# EAGLE schematic EEG_v2_8 (EAGLE 9.5.2)

## Sheet 1 of 2
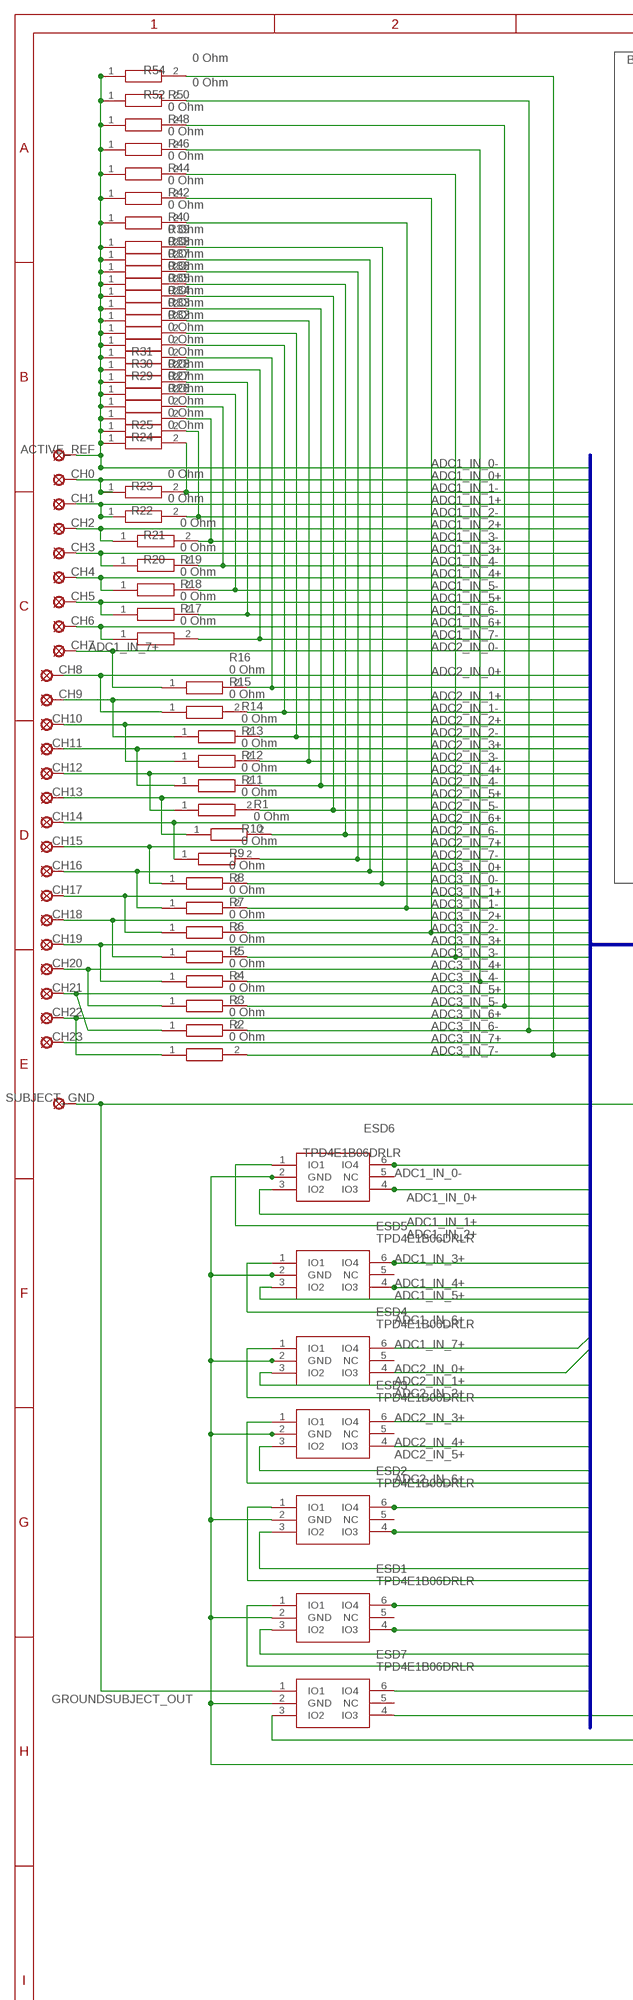
[diagram p0: schematic, sheet 1, part 1 of 2]
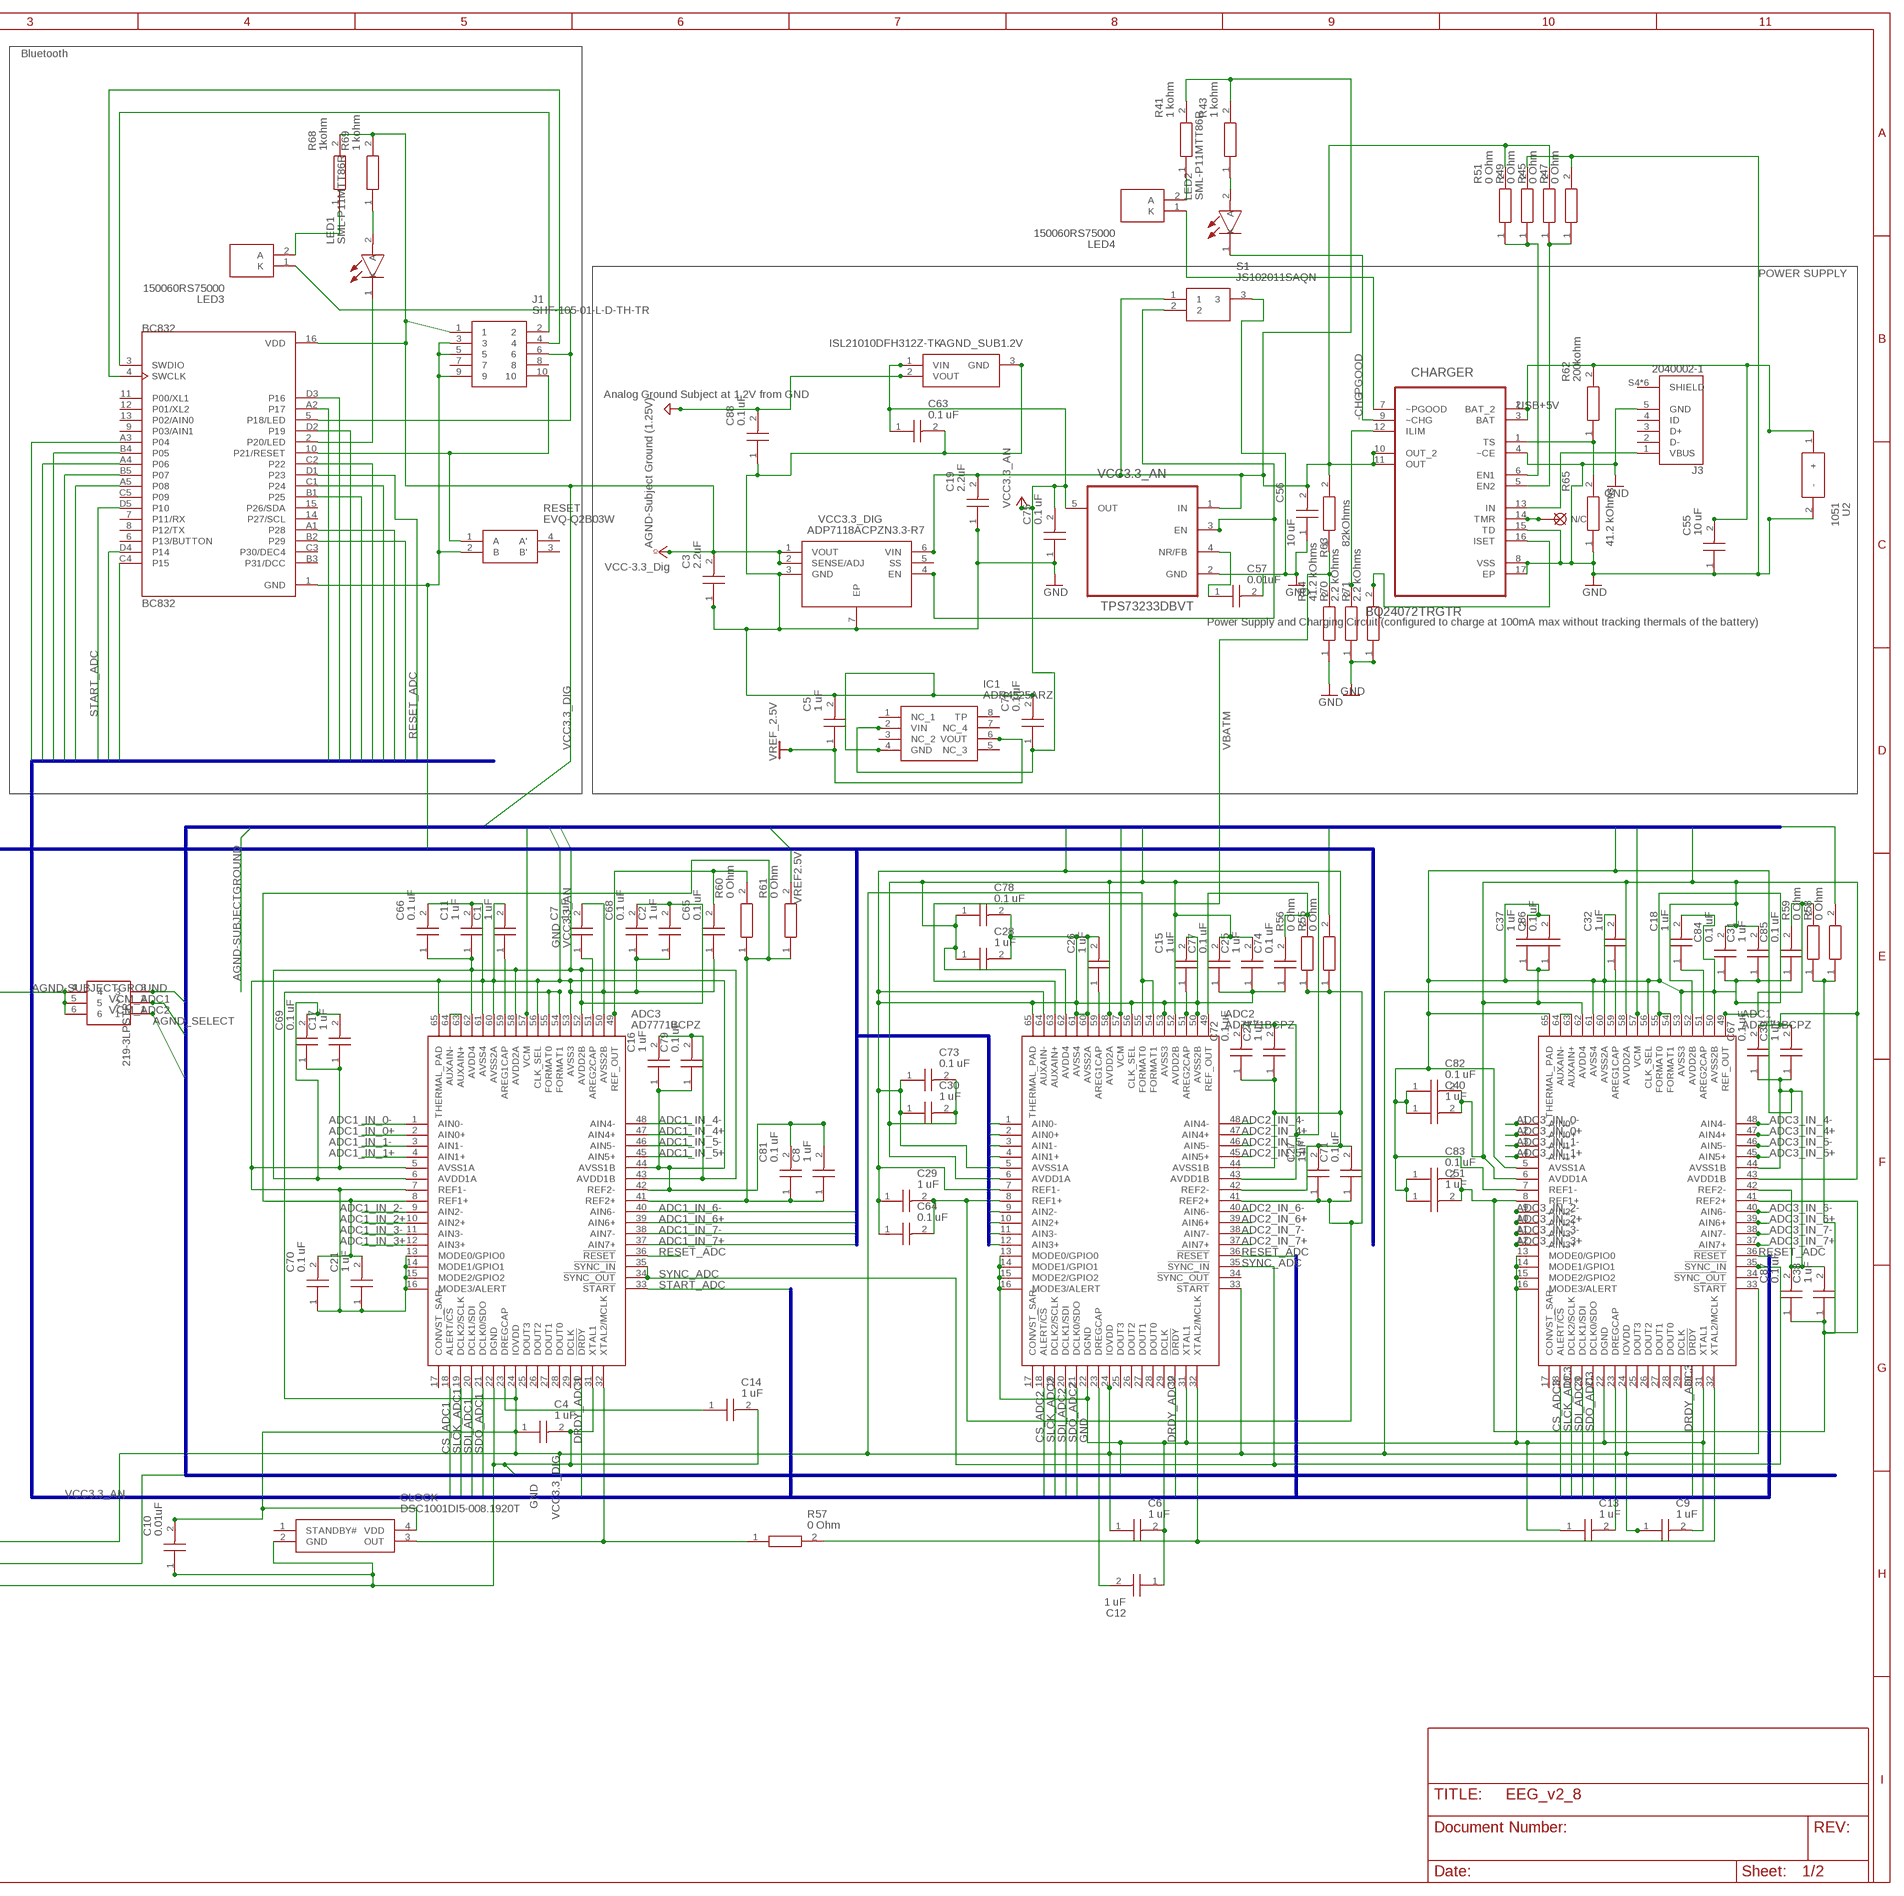
[diagram p1: schematic, sheet 1, part 2 of 2]

### Parts
ACTIVE_REF  SE11  [SE11]
ADC1  AD7771BCPZ  [QFN50P900X900X80-65N]
ADC2  AD7771BCPZ  [QFN50P900X900X80-65N]
ADC3  AD7771BCPZ  [QFN50P900X900X80-65N]
AGND_SELECT  219-3LPSTR  [2193LPSTR]
AGND_SUB1.2V  ISL21010DFH312Z-TK  [SOT95P237X112-3N]
BC832  BC832  [XCVR_BC832]
C1  1 uF  JMK105BJ105MP-F  [CAPC1005X33N]
C2  1 uF  JMK105BJ105MP-F  [CAPC1005X33N]
C3  2.2uF  GRM033R60J225ME47D  [CAPC0603X33N]
C4  1 uF  JMK105BJ105MP-F  [CAPC1005X33N]
C5  1 uF  JMK105BJ105MP-F  [CAPC1005X33N]
C6  1 uF  JMK105BJ105MP-F  [CAPC1005X33N]
C7  1 uF  JMK105BJ105MP-F  [CAPC1005X33N]
C8  1 uF  JMK105BJ105MP-F  [CAPC1005X33N]
C9  1 uF  JMK105BJ105MP-F  [CAPC1005X33N]
C10  0.01uF  GRM033R61E103MA12J  [CAPC0603X33N]
C11  1 uF  JMK105BJ105MP-F  [CAPC1005X33N]
C12  1 uF  JMK105BJ105MP-F  [CAPC1005X33N]
C13  1 uF  JMK105BJ105MP-F  [CAPC1005X33N]
C14  1 uF  JMK105BJ105MP-F  [CAPC1005X33N]
C15  1 uF  JMK105BJ105MP-F  [CAPC1005X33N]
C16  1 uF  JMK105BJ105MP-F  [CAPC1005X33N]
C17  1 uF  JMK105BJ105MP-F  [CAPC1005X33N]
C18  1 uF  JMK105BJ105MP-F  [CAPC1005X33N]
C19  2.2uF  GRM033R60J225ME47D  [CAPC0603X33N]
C21  1 uF  JMK105BJ105MP-F  [CAPC1005X33N]
C24  1 uF  JMK105BJ105MP-F  [CAPC1005X33N]
C25  1 uF  JMK105BJ105MP-F  [CAPC1005X33N]
C26  1 uF  JMK105BJ105MP-F  [CAPC1005X33N]
C27  1 uF  JMK105BJ105MP-F  [CAPC1005X33N]
C28  1 uF  JMK105BJ105MP-F  [CAPC1005X33N]
C29  1 uF  JMK105BJ105MP-F  [CAPC1005X33N]
C30  1 uF  JMK105BJ105MP-F  [CAPC1005X33N]
C31  1 uF  JMK105BJ105MP-F  [CAPC1005X33N]
C32  1 uF  JMK105BJ105MP-F  [CAPC1005X33N]
C37  1 uF  JMK105BJ105MP-F  [CAPC1005X33N]
C38  1 uF  JMK105BJ105MP-F  [CAPC1005X33N]
C39  1 uF  JMK105BJ105MP-F  [CAPC1005X33N]
C40  1 uF  JMK105BJ105MP-F  [CAPC1005X33N]
C51  1 uF  JMK105BJ105MP-F  [CAPC1005X33N]
C55  10 uF  EMK107BBJ106MA-T  [CAPC1608X100N]
C56  10 uF  EMK107BBJ106MA-T  [CAPC1608X100N]
C57  0.01uF  GRM033R61E103MA12J  [CAPC0603X33N]
C63  0.1 uF  LMK063C6104KP-F  [CAPC0603X33N]
C64  0.1 uF  LMK063C6104KP-F  [CAPC0603X33N]
C65  0.1 uF  LMK063C6104KP-F  [CAPC0603X33N]
C66  0.1 uF  LMK063C6104KP-F  [CAPC0603X33N]
C67  0.1 uF  LMK063C6104KP-F  [CAPC0603X33N]
C68  0.1 uF  LMK063C6104KP-F  [CAPC0603X33N]
C69  0.1 uF  LMK063C6104KP-F  [CAPC0603X33N]
C70  0.1 uF  LMK063C6104KP-F  [CAPC0603X33N]
C71  0.1 uF  LMK063C6104KP-F  [CAPC0603X33N]
C72  0.1 uF  LMK063C6104KP-F  [CAPC0603X33N]
C73  0.1 uF  LMK063C6104KP-F  [CAPC0603X33N]
C74  0.1 uF  LMK063C6104KP-F  [CAPC0603X33N]
C75  0.1 uF  LMK063C6104KP-F  [CAPC0603X33N]
C76  0.1 uF  LMK063C6104KP-F  [CAPC0603X33N]
C77  0.1 uF  LMK063C6104KP-F  [CAPC0603X33N]
C78  0.1 uF  LMK063C6104KP-F  [CAPC0603X33N]
C79  0.1 uF  LMK063C6104KP-F  [CAPC0603X33N]
C81  0.1 uF  LMK063C6104KP-F  [CAPC0603X33N]
C82  0.1 uF  LMK063C6104KP-F  [CAPC0603X33N]
C83  0.1 uF  LMK063C6104KP-F  [CAPC0603X33N]
C84  0.1 uF  LMK063C6104KP-F  [CAPC0603X33N]
C85  0.1 uF  LMK063C6104KP-F  [CAPC0603X33N]
C86  0.1 uF  LMK063C6104KP-F  [CAPC0603X33N]
C87  0.1 uF  LMK063C6104KP-F  [CAPC0603X33N]
C88  0.1 uF  LMK063C6104KP-F  [CAPC0603X33N]
CH0  SE11  [SE11]
CH1  SE11  [SE11]
CH2  SE11  [SE11]
CH3  SE11  [SE11]
CH4  SE11  [SE11]
CH5  SE11  [SE11]
CH6  SE11  [SE11]
CH7  SE11  [SE11]
CH8  SE11  [SE11]
CH9  SE11  [SE11]
CH10  SE11  [SE11]
CH11  SE11  [SE11]
CH12  SE11  [SE11]
CH13  SE11  [SE11]
CH14  SE11  [SE11]
CH15  SE11  [SE11]
CH16  SE11  [SE11]
CH17  SE11  [SE11]
CH18  SE11  [SE11]
CH19  SE11  [SE11]
CH20  SE11  [SE11]
CH21  SE11  [SE11]
CH22  SE11  [SE11]
CH23  SE11  [SE11]
CHARGER  BQ24072TRGTR  [QFN50P300X300X100-17N]
CLOCK  DSC1001DI5-008.1920T  [DSC1001DI50081920T]
ESD1  TPD4E1B06DRLR  [SOP50P160X60-6N]
ESD2  TPD4E1B06DRLR  [SOP50P160X60-6N]
ESD3  TPD4E1B06DRLR  [SOP50P160X60-6N]
ESD4  TPD4E1B06DRLR  [SOP50P160X60-6N]
ESD5  TPD4E1B06DRLR  [SOP50P160X60-6N]
ESD6  TPD4E1B06DRLR  [SOP50P160X60-6N]
ESD7  TPD4E1B06DRLR  [SOP50P160X60-6N]
IC1  ADR4525ARZ  [SOIC127P600X175-8N]
J1  SHF-105-01-L-D-TH-TR  [SHF10501LDTHTR]
J3  2040002-1  [TE_2040002-1]
LED1  SML-P11MTT86R  [LEDC1006X25N]
LED2  SML-P11MTT86R  [LEDC1006X25N]
LED3  150060RS75000  [LEDC1608X80N]
LED4  150060RS75000  [LEDC1608X80N]
R1  0 Ohm  CRCW06030000Z0EAC  [RESC1608X55N]
R2  0 Ohm  CRCW06030000Z0EAC  [RESC1608X55N]
R3  0 Ohm  CRCW06030000Z0EAC  [RESC1608X55N]
R4  0 Ohm  CRCW06030000Z0EAC  [RESC1608X55N]
R5  0 Ohm  CRCW06030000Z0EAC  [RESC1608X55N]
R6  0 Ohm  CRCW06030000Z0EAC  [RESC1608X55N]
R7  0 Ohm  CRCW06030000Z0EAC  [RESC1608X55N]
R8  0 Ohm  CRCW06030000Z0EAC  [RESC1608X55N]
R9  0 Ohm  CRCW06030000Z0EAC  [RESC1608X55N]
R10  0 Ohm  CRCW06030000Z0EAC  [RESC1608X55N]
R11  0 Ohm  CRCW06030000Z0EAC  [RESC1608X55N]
R12  0 Ohm  CRCW06030000Z0EAC  [RESC1608X55N]
R13  0 Ohm  CRCW06030000Z0EAC  [RESC1608X55N]
R14  0 Ohm  CRCW06030000Z0EAC  [RESC1608X55N]
R15  0 Ohm  CRCW06030000Z0EAC  [RESC1608X55N]
R16  0 Ohm  CRCW06030000Z0EAC  [RESC1608X55N]
R17  0 Ohm  CRCW06030000Z0EAC  [RESC1608X55N]
R18  0 Ohm  CRCW06030000Z0EAC  [RESC1608X55N]
R19  0 Ohm  CRCW06030000Z0EAC  [RESC1608X55N]
R20  0 Ohm  CRCW06030000Z0EAC  [RESC1608X55N]
R21  0 Ohm  CRCW06030000Z0EAC  [RESC1608X55N]
R22  0 Ohm  CRCW06030000Z0EAC  [RESC1608X55N]
R23  0 Ohm  CRCW06030000Z0EAC  [RESC1608X55N]
R24  0 Ohm  CRCW06030000Z0EAC  [RESC1608X55N]
R25  0 Ohm  CRCW06030000Z0EAC  [RESC1608X55N]
R26  0 Ohm  CRCW06030000Z0EAC  [RESC1608X55N]
R27  0 Ohm  CRCW06030000Z0EAC  [RESC1608X55N]
R28  0 Ohm  CRCW06030000Z0EAC  [RESC1608X55N]
R29  0 Ohm  CRCW06030000Z0EAC  [RESC1608X55N]
R30  0 Ohm  CRCW06030000Z0EAC  [RESC1608X55N]
R31  0 Ohm  CRCW06030000Z0EAC  [RESC1608X55N]
R32  0 Ohm  CRCW06030000Z0EAC  [RESC1608X55N]
R33  0 Ohm  CRCW06030000Z0EAC  [RESC1608X55N]
R34  0 Ohm  CRCW06030000Z0EAC  [RESC1608X55N]
R35  0 Ohm  CRCW06030000Z0EAC  [RESC1608X55N]
R36  0 Ohm  CRCW06030000Z0EAC  [RESC1608X55N]
R37  0 Ohm  CRCW06030000Z0EAC  [RESC1608X55N]
R38  0 Ohm  CRCW06030000Z0EAC  [RESC1608X55N]
R39  0 Ohm  CRCW06030000Z0EAC  [RESC1608X55N]
R40  0 Ohm  CRCW06030000Z0EAC  [RESC1608X55N]
R41  1 kohm  RC0201JR-071KL  [RESC0603X26N]
R42  0 Ohm  CRCW06030000Z0EAC  [RESC1608X55N]
R43  1 kohm  RC0201JR-071KL  [RESC0603X26N]
R44  0 Ohm  CRCW06030000Z0EAC  [RESC1608X55N]
R45  0 Ohm  CRCW06030000Z0EAC  [RESC1608X55N]
R46  0 Ohm  CRCW06030000Z0EAC  [RESC1608X55N]
R47  0 Ohm  CRCW06030000Z0EAC  [RESC1608X55N]
R48  0 Ohm  CRCW06030000Z0EAC  [RESC1608X55N]
R49  0 Ohm  CRCW06030000Z0EAC  [RESC1608X55N]
R50  0 Ohm  CRCW06030000Z0EAC  [RESC1608X55N]
R51  0 Ohm  CRCW06030000Z0EAC  [RESC1608X55N]
R52  0 Ohm  CRCW06030000Z0EAC  [RESC1608X55N]
R54  0 Ohm  CRCW06030000Z0EAC  [RESC1608X55N]
R55  0 Ohm  CRCW06030000Z0EAC  [RESC1608X55N]
R56  0 Ohm  CRCW06030000Z0EAC  [RESC1608X55N]
R57  0 Ohm  CRCW06030000Z0EAC  [RESC1608X55N]
R58  0 Ohm  CRCW06030000Z0EAC  [RESC1608X55N]
R59  0 Ohm  CRCW06030000Z0EAC  [RESC1608X55N]
R60  0 Ohm  CRCW06030000Z0EAC  [RESC1608X55N]
R61  0 Ohm  CRCW06030000Z0EAC  [RESC1608X55N]
R62  200kohm  CRCW0201200KFNED  [RESC0603X28N]
R63  82kOhms  ERA-3AEB823V  [RESC1608X55N]
R64  41.2 kOhms  CRCW020141K2FNED  [RESC0603X28N]
R65  41.2 kOhms  CRCW020141K2FNED  [RESC0603X28N]
R68  1kohm  RC0201JR-071KL  [RESC0603X26N]
R69  1 kohm  RC0201JR-071KL  [RESC0603X26N]
R70  2.2 kOhms  RC0603JR-072K2L  [RESC1608X55N]
R71  2.2 kOhms  RC0603JR-072K2L  [RESC1608X55N]
RESET  EVQ-Q2B03W  [EVQQ2]
S1  JS102011SAQN  [JS102011SAQN]
SUBJECT_GND  SE11  [SE11]
U2  1051  [1051]
U$13  N/C  (no package)
VCC3.3_AN  TPS73233DBVT  [SOT95P280X145-5N]
VCC3.3_DIG  ADP7118ACPZN3.3-R7  [SON65P200X200X65-7N]

### Nets
-CHG: CHARGER.9(~CHG) LED2.1(K)
-PGOOD: CHARGER.7(~PGOOD) LED4.1(K)
ADC1_IN_0+: ADC3.2(AIN0+) CH0.MP ESD6.4(IO3) R23.1
ADC1_IN_0-: ACTIVE_REF.MP ADC3.1(AIN0-) ESD6.6(IO4) R24.1 R25.1 R26.1 R27.1 R28.1 R29.1 R30.1 R31.1 R32.1 R33.1 R34.1 R35.1 R36.1 R37.1 R38.1 R39.1 R40.1 R42.1 R44.1 R46.1 R48.1 R50.1 R52.1 R54.1
ADC1_IN_1+: ADC3.4(AIN1+) CH1.MP ESD6.3(IO2) R22.1
ADC1_IN_1-: ADC3.3(AIN1-) R23.2 R24.2
ADC1_IN_2+: ADC3.10(AIN2+) CH2.MP ESD6.1(IO1) R21.1
ADC1_IN_2-: ADC3.9(AIN2-) R22.2 R25.2
ADC1_IN_3+: ADC3.12(AIN3+) CH3.MP ESD5.6(IO4) R20.1
ADC1_IN_3-: ADC3.11(AIN3-) R21.2 R26.2
ADC1_IN_4+: ADC3.47(AIN4+) CH4.MP ESD5.4(IO3) R19.1
ADC1_IN_4-: ADC3.48(AIN4-) R20.2 R27.2
ADC1_IN_5+: ADC3.45(AIN5+) CH5.MP ESD5.3(IO2) R18.1
ADC1_IN_5-: ADC3.46(AIN5-) R19.2 R28.2
ADC1_IN_6+: ADC3.39(AIN6+) CH6.MP ESD5.1(IO1) R17.1
ADC1_IN_6-: ADC3.40(AIN6-) R18.2 R29.2
ADC1_IN_7+: ADC3.37(AIN7+) CH7.MP ESD4.4(IO3) R16.1
ADC1_IN_7-: ADC3.38(AIN7-) R17.2 R30.2
ADC2_IN_0+: ADC2.2(AIN0+) CH8.MP ESD4.6(IO4) R15.1
ADC2_IN_0-: ADC2.1(AIN0-) R16.2 R31.2
ADC2_IN_1+: ADC2.4(AIN1+) CH9.MP ESD4.3(IO2) R14.1
ADC2_IN_1-: ADC2.3(AIN1-) R15.2 R32.2
ADC2_IN_2+: ADC2.10(AIN2+) CH10.MP ESD4.1(IO1) R13.1
ADC2_IN_2-: ADC2.9(AIN2-) R14.2 R33.2
ADC2_IN_3+: ADC2.12(AIN3+) CH11.MP ESD3.4(IO3) R12.1
ADC2_IN_3-: ADC2.11(AIN3-) R13.2 R34.2
ADC2_IN_4+: ADC2.47(AIN4+) CH12.MP ESD3.6(IO4) R11.1
ADC2_IN_4-: ADC2.48(AIN4-) R12.2 R35.2
ADC2_IN_5+: ADC2.45(AIN5+) CH13.MP ESD3.3(IO2) R1.1
ADC2_IN_5-: ADC2.46(AIN5-) R11.2 R36.2
ADC2_IN_6+: ADC2.39(AIN6+) CH14.MP ESD3.1(IO1) R10.1
ADC2_IN_6-: ADC2.40(AIN6-) R1.2 R37.2
ADC2_IN_7+: ADC2.37(AIN7+) CH15.MP ESD2.6(IO4) R9.1
ADC2_IN_7-: ADC2.38(AIN7-) R10.2 R38.2
ADC3_IN_0+: ADC1.2(AIN0+) CH16.MP ESD2.4(IO3) R8.1 R39.2
ADC3_IN_0-: ADC1.1(AIN0-) R9.2 R40.2
ADC3_IN_1+: ADC1.4(AIN1+) CH17.MP ESD2.3(IO2) R7.1
ADC3_IN_1-: ADC1.3(AIN1-) R8.2 R42.2
ADC3_IN_2+: ADC1.10(AIN2+) CH18.MP ESD2.1(IO1) R6.1
ADC3_IN_2-: ADC1.9(AIN2-) R7.2 R44.2
ADC3_IN_3+: ADC1.12(AIN3+) CH19.MP ESD1.6(IO4) R5.1
ADC3_IN_3-: ADC1.11(AIN3-) R6.2 R46.2
ADC3_IN_4+: ADC1.47(AIN4+) CH20.MP ESD1.4(IO3) R4.1
ADC3_IN_4-: ADC1.48(AIN4-) R5.2 R48.2
ADC3_IN_5+: ADC1.45(AIN5+) CH21.MP ESD1.3(IO2) R3.1
ADC3_IN_5-: ADC1.46(AIN5-) R4.2 R50.2
ADC3_IN_6+: ADC1.39(AIN6+) CH22.MP ESD1.1(IO1) R2.1
ADC3_IN_6-: ADC1.40(AIN6-) R3.2 R52.2
ADC3_IN_7+: ADC1.37(AIN7+) CH23.MP ESD7.6(IO4)
ADC3_IN_7-: ADC1.38(AIN7-) R2.2 R54.2
AGND-SUBJECTGROUND [power]: AGND_SELECT.3 AGND_SUB1.2V.2(VOUT) C88.2 ; supply symbol labelled AGND-Subject Ground (1.25V)
CS_ADC1: ADC3.18(ALERT/!CS) BC832.A4(P06)
CS_ADC2: ADC2.18(ALERT/!CS) BC832.A5(P08)
CS_ADC3: ADC1.18(ALERT/!CS) BC832.C1(P24)
DRDY_ADC1: ADC3.30(!DRDY) BC832.A2(P17)
DRDY_ADC2: ADC2.30(!DRDY) BC832.D4(P14)
DRDY_ADC3: ADC1.30(!DRDY) BC832.B1(P25)
GND [power]: ADC1.5(AVSS1A) ADC1.7(REF1-) ADC1.13(MODE0/GPIO0) ADC1.14(MODE1/GPIO1) ADC1.15(MODE2/GPIO2) ADC1.16(MODE3/ALERT) ADC1.22(DGND) ADC1.31(XTAL1) ADC1.42(REF2-) ADC1.44(AVSS1B) ADC1.50(AVSS2B) ADC1.53(AVSS3) ADC1.56(CLK_SEL) ADC1.60(AVSS2A) ADC1.61(AVSS4) ADC1.65(THERMAL_PAD) ADC2.5(AVSS1A) ADC2.7(REF1-) ADC2.13(MODE0/GPIO0) ADC2.14(MODE1/GPIO1) ADC2.15(MODE2/GPIO2) ADC2.16(MODE3/ALERT) ADC2.22(DGND) ADC2.31(XTAL1) ADC2.42(REF2-) ADC2.44(AVSS1B) ADC2.50(AVSS2B) ADC2.53(AVSS3) ADC2.56(CLK_SEL) ADC2.60(AVSS2A) ADC2.61(AVSS4) ADC2.64(AUXAIN-) ADC2.65(THERMAL_PAD) ADC3.5(AVSS1A) ADC3.7(REF1-) ADC3.13(MODE0/GPIO0) ADC3.14(MODE1/GPIO1) ADC3.15(MODE2/GPIO2) ADC3.16(MODE3/ALERT) ADC3.22(DGND) ADC3.31(XTAL1) ADC3.42(REF2-) ADC3.44(AVSS1B) ADC3.50(AVSS2B) ADC3.53(AVSS3) ADC3.56(CLK_SEL) ADC3.60(AVSS2A) ADC3.61(AVSS4) ADC3.65(THERMAL_PAD) AGND_SUB1.2V.3(GND) BC832.1(GND) C1.2 C2.1 C3.1 C4.2 C5.2 C6.2 C7.2 C8.2 C9.2 C10.1 C11.2 C12.1 C13.1 C14.2 C15.2 C16.1 C17.1 C18.2 C19.1 C21.1 C24.1 C25.1 C26.2 C27.2 C28.2 C29.1 C30.1 C31.1 C32.2 C37.2 C38.2 C39.1 C40.1 C51.1 C55.1 C56.1 C57.2 C63.2 C64.1 C65.1 C66.2 C67.1 C68.1 C69.1 C70.1 C71.2 C72.1 C73.1 C74.1 C75.1 C76.2 C77.1 C78.2 C79.1 C81.2 C82.1 C83.1 C84.1 C85.1 C86.2 C87.2 C88.1 CHARGER.4(~CE) CHARGER.8(VSS) CHARGER.15(TD) CHARGER.17(EP) CLOCK.2(GND) ESD1.2(GND) ESD2.2(GND) ESD3.2(GND) ESD4.2(GND) ESD5.2(GND) ESD6.2(GND) ESD7.2(GND) IC1.4(GND) J1.3 J1.5 J1.9 J3.5(GND) R47.2 R49.2 R64.1 R65.1 R70.1 R71.1 RESET.2(B) S1.3 U2.2(-) VCC3.3_AN.2(GND) VCC3.3_DIG.3(GND) VCC3.3_DIG.7(EP)
GROUNDSUBJECT_OUT [power]: AGND_SELECT.4 AGND_SELECT.5 AGND_SELECT.6 ESD7.1(IO1) SUBJECT_GND.MP
N$1: ADC3.59(AREG1CAP) C1.1
N$2: ADC2.23(DREGCAP) C12.2
N$3: ADC2.49(REF_OUT) C74.2 R56.2
N$4: ADC1.49(REF_OUT) C85.2 R59.2
N$5: CHARGER.6(EN1) R49.1 R51.1
N$6: BC832.2(P20/LED) LED1.1(K)
N$7: ADC3.63(AUXAIN+) ADC3.64(AUXAIN-)
N$8: ADC3.51(AREG2CAP) C7.1
N$9: S1.2 VCC3.3_AN.3(EN) VCC3.3_DIG.4(EN)
N$10: LED3.2(A) R68.1
N$11: LED1.2(A) R69.1
N$12: LED4.2(A) R41.1
N$13: ADC2.51(AREG2CAP) C15.1
N$14: ADC3.23(DREGCAP) C14.1
N$15: CHARGER.5(EN2) R45.1 R47.1
N$16: ADC1.23(DREGCAP) C13.2
N$17: LED2.2(A) R43.1
N$19: C57.1 VCC3.3_AN.4(NR/FB)
N$20: ADC1.63(AUXAIN+) ADC1.64(AUXAIN-)
N$21: ADC1.59(AREG1CAP) C32.1
N$22: ADC2.59(AREG1CAP) C26.1
N$26: ADC1.51(AREG2CAP) C18.1
N$31: ADC2.8(REF1+) ADC2.41(REF2+) C27.1 C29.2 C64.2 C71.1 R55.1 R56.1
N$38: ADC1.8(REF1+) ADC1.41(REF2+) C38.1 C51.2 C83.2 C87.1 R58.1 R59.1
N$39: CHARGER.1(TS) R62.1 R65.2
N$53: CHARGER.14(TMR) U$13.N/C
N$58: CHARGER.16(ISET) R71.2
N$60: CHARGER.12(ILIM) R70.2
P18/LED: BC832.5(P18/LED) J1.6 LED3.1(K)
REF_ADC1_IN: ADC3.8(REF1+) ADC3.41(REF2+) C8.1 C21.2 C70.2 C81.1 R60.1 R61.1
REF_ADC1_OUT: ADC3.49(REF_OUT) C65.2 R60.2
RESET: BC832.10(P21/RESET) J1.10 RESET.1(A)
RESET_ADC: ADC1.36(!RESET) ADC2.36(!RESET) ADC3.36(!RESET) BC832.D1(P23)
SDCLK: BC832.4(SWCLK) J1.4
SDI_ADC1: ADC3.20(DCLK1/SDI) BC832.C4(P15)
SDI_ADC2: ADC2.20(DCLK1/SDI) BC832.B5(P07)
SDI_ADC3: ADC1.20(DCLK1/SDI) BC832.A1(P28)
SDIO: BC832.3(SWDIO) J1.2
SDO_ADC1: ADC3.21(DCLK0/SDO) BC832.D3(P16)
SDO_ADC2: ADC2.21(DCLK0/SDO) BC832.B4(P05)
SDO_ADC3: ADC1.21(DCLK0/SDO) BC832.B2(P29)
SLCK_ADC1: ADC3.19(DCLK2/SCLK) BC832.A3(P04)
SLCK_ADC2: ADC2.19(DCLK2/SCLK) BC832.D2(P19)
SLCK_ADC3: ADC1.19(DCLK2/SCLK) BC832.C2(P22)
START_ADC: ADC3.33(!START) BC832.D5(P10)
SYNC_ADC: ADC1.35(!SYNC_IN) ADC2.35(!SYNC_IN) ADC3.34(!SYNC_OUT) ADC3.35(!SYNC_IN)
USB+5V [power]: CHARGER.13(IN) J3.1(VBUS)
V_OUT: C19.2 C56.2 CHARGER.10(OUT_2) CHARGER.11(OUT) R41.2 R43.2 R45.2 R51.2 R63.2 S1.1 VCC3.3_AN.1(IN) VCC3.3_DIG.6(VIN)
VBATM [power]: ADC2.63(AUXAIN+) R63.1 R64.2
VCC3.3_AN [power2]: ADC1.6(AVDD1A) ADC1.43(AVDD1B) ADC1.52(AVDD2B) ADC1.58(AVDD2A) ADC1.62(AVDD4) ADC2.6(AVDD1A) ADC2.43(AVDD1B) ADC2.52(AVDD2B) ADC2.58(AVDD2A) ADC2.62(AVDD4) ADC3.6(AVDD1A) ADC3.43(AVDD1B) ADC3.52(AVDD2B) ADC3.58(AVDD2A) ADC3.62(AVDD4) AGND_SUB1.2V.1(VIN) C2.2 C11.1 C16.2 C17.2 C24.2 C25.2 C28.1 C30.2 C31.2 C37.1 C39.2 C40.2 C63.1 C66.1 C67.2 C68.2 C69.2 C72.2 C73.2 C75.2 C76.1 C77.2 C78.1 C79.2 C82.2 C84.2 C86.1 ESD7.3(IO2) IC1.2(VIN) VCC3.3_AN.5(OUT)
VCC3.3_DIG [power2]: ADC1.24(IOVDD) ADC1.33(!START) ADC1.54(FORMAT1) ADC1.55(FORMAT0) ADC2.24(IOVDD) ADC2.33(!START) ADC2.54(FORMAT1) ADC2.55(FORMAT0) ADC3.24(IOVDD) ADC3.54(FORMAT1) ADC3.55(FORMAT0) BC832.16(VDD) C3.2 C4.1 C6.1 C9.1 C10.2 CLOCK.4(VDD) ESD7.4(IO3) J1.1 R68.2 R69.2 VCC3.3_DIG.1(VOUT) VCC3.3_DIG.2(SENSE/ADJ) ; supply symbol labelled VCC-3.3_Dig
VCC_BATTERY [power2]: C55.2 CHARGER.2(BAT_2) CHARGER.3(BAT) R62.2 U2.1(+)
VCM_ADC1: ADC3.57(VCM) AGND_SELECT.2
VCM_ADC2: ADC2.57(VCM) AGND_SELECT.1
VCM_ADC3: ADC1.57(VCM)
VREF2.5V: C5.1 IC1.6(VOUT) R55.2 R58.2 R61.2 ; supply symbol labelled VREF_2.5V
XTAL_OUT: ADC3.32(XTAL2/MCLK) CLOCK.3(OUT) R57.1
XTAL_OUT_SWITCHED: ADC1.32(XTAL2/MCLK) ADC2.32(XTAL2/MCLK) R57.2
Unconnected: ADC1.17(CONVST_SAR) ADC1.25(DOUT3) ADC1.26(DOUT2) ADC1.27(DOUT1) ADC1.28(DOUT0) ADC1.29(DCLK) ADC1.34(!SYNC_OUT) ADC2.17(CONVST_SAR) ADC2.25(DOUT3) ADC2.26(DOUT2) ADC2.27(DOUT1) ADC2.28(DOUT0) ADC2.29(DCLK) ADC2.34(!SYNC_OUT) ADC3.17(CONVST_SAR) ADC3.25(DOUT3) ADC3.26(DOUT2) ADC3.27(DOUT1) ADC3.28(DOUT0) ADC3.29(DCLK) BC832.6(P13/BUTTON) BC832.7(P11/RX) BC832.8(P12/TX) BC832.9(P03/AIN1) BC832.11(P00/XL1) BC832.12(P01/XL2) BC832.13(P02/AIN0) BC832.14(P27/SCL) BC832.15(P26/SDA) BC832.B3(P31/DCC) BC832.C3(P30/DEC4) BC832.C5(P09) CLOCK.1(STANDBY#) ESD1.5(NC) ESD2.5(NC) ESD3.5(NC) ESD4.5(NC) ESD5.5(NC) ESD6.5(NC) ESD7.5(NC) IC1.1(NC_1) IC1.3(NC_2) IC1.5(NC_3) IC1.7(NC_4) IC1.8(TP) J1.7 J1.8 J3.2(D-) J3.3(D+) J3.4(ID) RESET.3(B') RESET.4(A') VCC3.3_DIG.5(SS)

### Buses
ADC1_IN_0-,ADC1_IN_0+,ADC1_IN_1-,ADC1_IN_1+,ADC1_IN_2-,ADC1_IN_2+,ADC1_IN_3-,ADC1_IN_3+,ADC1_IN_4-,ADC1_IN_4+,ADC1_IN_5-,ADC1_IN_5+,ADC1_IN_6-,ADC1_IN_6+,ADC1_IN_7-,ADC1_IN_7+,ADC2_IN_0+,ADC2_IN_0-,ADC2_IN_1+,ADC2_IN_1-,ADC2_IN_2+,ADC2_IN_2-,ADC2_IN_3+,ADC2_IN_3-,ADC2_IN_4+,ADC2_IN_4-,ADC2_IN_5+,ADC2_IN_5-,ADC2_IN_6+,ADC2_IN_6-,ADC2_IN_7+,ADC2_IN_7-,ADC3_IN_0-,ADC3_IN_0+,ADC3_IN_1-,ADC3_IN_1+,ADC3_IN_2-,ADC3_IN_2+,ADC3_IN_3+,ADC3_IN_3-,ADC3_IN_4-,ADC3_IN_4+,ADC3_IN_5-,ADC3_IN_5+,ADC3_IN_6-,ADC3_IN_6+,ADC3_IN_7-,ADC3_IN_7+,GND,N$52,VCC3.3_AN,VREF2.5V
POWER:AGND-SUBJECTGROUND,GND,VCC3.3_AN,VCC3.3_DIG,VCM_ADC1,VCM_ADC2,VCM_ADC3,VREF2.5V
CS_ADC1,CS_ADC2,CS_ADC3,DRDY_ADC1,DRDY_ADC2,DRDY_ADC3,RESET_ADC,SDI_ADC1,SDI_ADC2,SDI_ADC3,SDO_ADC1,SDO_ADC2,SDO_ADC3,SLCK_ADC1,SLCK_ADC2,SLCK_ADC3,START_ADC

### Notes on the sheet
- Bluetooth
- POWER SUPPLY
- Analog Ground Subject at 1.2V from GND
- Power Supply and Charging Circuit (configured to charge at 100mA max without tracking thermals of the battery)

## Sheet 2 of 2

## Power pins joined to a net without a drawn wire
SHIELD: J3.S4(SHIELD) J3.S5(SHIELD) J3.SH1(SHIELD) J3.SH2(SHIELD) J3.SH3(SHIELD) J3.SH4(SHIELD)

## Library data of the parts
ACTIVE_REF CH0 CH1-CH23 SUBJECT_GND = solpad:SE11: SOLDER PAD RTM, drill 1,1mm, distributor Buerklin, 07F810
ADC1-ADC3 = AD7771BCPZ:AD7771BCPZ: Analog to Digital Converters - ADC Eight 24B 128ksps SD-ADC PGA SRC Source: Datasheet <http://www.analog.com/media/en/technical-documentation/data-sheets/AD7771.pdf>; DESCRIPTION: Analog to Digital Converters - ADC Eight 24B 128ksps SD-ADC PGA SRC; HEIGHT: 0.8mm; MANUFACTURER_NAME: Analog Devices; MANUFACTURER_PART_NUMBER: AD7771BCPZ; MOUSER_PART_NUMBER: 584-AD7771BCPZ; MOUSER_PRICE-STOCK: https://www.mouser.com/Search/Refine.aspx?Keyword=584-AD7771BCPZ
AGND_SELECT = SamacSys_Parts:219-3LPSTR: 3 Way Surface Mount DIP Switch Single Pole Single Throw (SPST) Source: Datasheet <https://www.ctscorp.com/wp-content/uploads/219.pdf>; DESCRIPTION: 3 Way Surface Mount DIP Switch Single Pole Single Throw (SPST); HEIGHT: 3.95mm; MANUFACTURER_NAME: CTS; MANUFACTURER_PART_NUMBER: 219-3LPSTR; MOUSER_PART_NUMBER: 774-2193LPSTR; MOUSER_PRICE-STOCK: https://www.mouser.com/Search/Refine.aspx?Keyword=774-2193LPSTR; RS_PART_NUMBER: 1774327; RS_PRICE-STOCK: http://uk.rs-online.com/web/p/products/1774327
AGND_SUB1.2V = SamacSys_Parts:ISL21010DFH312Z-TK: Voltage References Micropower Voltage Reference Source: Datasheet <https://www.renesas.com/en-us/www/doc/datasheet/isl21010.pdf>; DESCRIPTION: Voltage References Micropower Voltage Reference; HEIGHT: 1.12mm; MANUFACTURER_NAME: Renesas Electronics; MANUFACTURER_PART_NUMBER: ISL21010DFH312Z-TK; MOUSER_PART_NUMBER: 968-ISL21010DFH312ZT; MOUSER_PRICE-STOCK: https://www.mouser.com/Search/ProductDetail.aspx?qs=9fLuogzTs8LVsLxgRfQnrw%3d%3d
BC832 = BC832:BC832: Micro BLE 5 Module: Nordic nRF52832 SoC with chip antenna and castellated pins; AVAILABILITY: Unavailable; DESCRIPTION: Bluetooth Bluetooth v5.0 Transceiver Module 2.4GHz Integrated, Chip Surface Mount; MF: Fanstel Corp.; MP: BC832; PACKAGE: Module Fanstel Corp.; PRICE: None
C1 C2 C4-C9 C11-C18 C21 C24-C32 C37-C40 C51 = JMK105BJ105MP-F:JMK105BJ105MP-F: Taiyo Yuden JMK105BJ105MP-F 1F MLCC 6.3V dc +/-20% Tolerance SMD Source: Datasheet <https://componentsearchengine.com/Datasheets/1/JMK105BJ105MP-F.pdf>; DESCRIPTION: Taiyo Yuden JMK105BJ105MP-F 1F MLCC 6.3V dc +/-20% Tolerance SMD; HEIGHT: 0.33mm; MANUFACTURER_NAME: TAIYO YUDEN; MANUFACTURER_PART_NUMBER: JMK105BJ105MP-F; MOUSER_PART_NUMBER: 963-JMK105BJ105MP-F; MOUSER_PRICE-STOCK: https://www.mouser.com/Search/Refine.aspx?Keyword=963-JMK105BJ105MP-F; RS_PART_NUMBER: 1843471; RS_PRICE-STOCK: https://uk.rs-online.com/web/p/products/1843471
C3 C19 = SamacSys_Parts:GRM033R60J225ME47D: Multilayer Ceramic Capacitors MLCC - SMD/SMT 0201 2.2uF 6.3volts Source: Datasheet <https://componentsearchengine.com/Datasheets/1/GRM033R60J225ME47D.pdf>; DESCRIPTION: Multilayer Ceramic Capacitors MLCC - SMD/SMT 0201 2.2uF 6.3volts; HEIGHT: 0.33mm; MANUFACTURER_NAME: Murata Electronics; MANUFACTURER_PART_NUMBER: GRM033R60J225ME47D; MOUSER_PART_NUMBER: 81-GRM033R60J225ME7D; MOUSER_PRICE-STOCK: https://www.mouser.com/Search/Refine.aspx?Keyword=81-GRM033R60J225ME7D
C10 C57 = GRM033R61E103MA12J:GRM033R61E103MA12J: Multilayer Ceramic Capacitors MLCC - SMD/SMT 0201 0.01uF 25volts *Derate Voltage/Temp Source: Datasheet <https://psearch.en.murata.com/capacitor/product/GRM033R61E103MA12#.html>; DESCRIPTION: Multilayer Ceramic Capacitors MLCC - SMD/SMT 0201 0.01uF 25volts *Derate Voltage/Temp; HEIGHT: 0.33mm; MANUFACTURER_NAME: Murata Electronics; MANUFACTURER_PART_NUMBER: GRM033R61E103MA12J; MOUSER_PART_NUMBER: 81-GRM033R61E103MA2J; MOUSER_PRICE-STOCK: https://www.mouser.co.uk/ProductDetail/Murata-Electronics/GRM033R61E103MA12J?qs=hNud%2FORuBR1kPmeKqdhtJA%3D%3D
C55 C56 = EMK107BBJ106MA-T:EMK107BBJ106MA-T: TAIYO YUDEN - EMK107BBJ106MA-T - CAPACITOR, MLCC, X5R, 10UF, 16V, 0603, REEL Source: Datasheet <https://altium.componentsearchengine.com/Datasheets/2/EMK107BBJ106MA-T.pdf>; DESCRIPTION: TAIYO YUDEN - EMK107BBJ106MA-T - CAPACITOR, MLCC, X5R, 10UF, 16V, 0603, REEL; HEIGHT: 1mm; MANUFACTURER_NAME: TAIYO YUDEN; MANUFACTURER_PART_NUMBER: EMK107BBJ106MA-T; MOUSER_PART_NUMBER: 963-EMK107BBJ106MA-T; MOUSER_PRICE-STOCK: https://www.mouser.com/Search/Refine.aspx?Keyword=963-EMK107BBJ106MA-T; RS_PART_NUMBER: 1843904P; RS_PRICE-STOCK: http://uk.rs-online.com/web/p/products/1843904P
C63-C79 C81-C88 = LMK063C6104KP-F:LMK063C6104KP-F: 0201 (0603M), 0402 (1005M) 100nF MLCC 10V dc +/-10% SMD LMK063C6104KP-F Source: Datasheet <https://componentsearchengine.com/Datasheets/1/LMK063C6104KP-F.pdf>; DESCRIPTION: 0201 (0603M), 0402 (1005M) 100nF MLCC 10V dc +/-10% SMD LMK063C6104KP-F; HEIGHT: 0.33mm; MANUFACTURER_NAME: TAIYO YUDEN; MANUFACTURER_PART_NUMBER: LMK063C6104KP-F; MOUSER_PART_NUMBER: 963-LMK063C6104KP-F; MOUSER_PRICE-STOCK: https://www.mouser.co.uk/ProductDetail/Taiyo-Yuden/LMK063C6104KP-F?qs=vF%252B8ahGVildHIKWi2d6PKQ%3D%3D; RS_PART_NUMBER: 1843409P; RS_PRICE-STOCK: http://uk.rs-online.com/web/p/products/1843409P
CHARGER = ti:BQ24072TRGTR: 1.5A USB-Friendly Li-Ion Battery Charger and Power-Path Management IC; MPN: BQ24072TRGTR; OC_FARNELL: -; OC_NEWARK: 74R6078; PACKAGE: QFN-16; SUPPLIER: Texas Instruments
CLOCK = DSC1001DI5-008.1920T:DSC1001DI5-008.1920T: Standard Clock Oscillators MEMS Oscillator, Low Power, -40C-85C, 10ppm 1.8V-3.3V Low-Power Precision CMOS Oscillators Source: Datasheet <https://www.mouser.co.uk/datasheet/2/268/20005529A-1149183.pdf>; DESCRIPTION: Standard Clock Oscillators MEMS Oscillator, Low Power, -40C-85C, 10ppm 1.8V-3.3V Low-Power Precision CMOS Oscillators; HEIGHT: 0.85mm; MANUFACTURER_NAME: Microchip; MANUFACTURER_PART_NUMBER: DSC1001DI5-008.1920T; MOUSER_PART_NUMBER: 998-1001DI5008.1920T; MOUSER_PRICE-STOCK: https://www.mouser.co.uk/ProductDetail/Microchip-Technology-Micrel/DSC1001DI5-0081920T?qs=moDRE%2FDosU0uLfPLWfhb9w%3D%3D
ESD1-ESD7 = TPD4E1B06DRLR:TPD4E1B06DRLR: Bidirectional Quad-Channel High-Speed ESD Protection Device Source: Datasheet <http://www.ti.com/lit/ds/symlink/tpd4e1b06.pdf>; DESCRIPTION: Bidirectional Quad-Channel High-Speed ESD Protection Device; HEIGHT: 0.6mm; MANUFACTURER_NAME: Texas Instruments; MANUFACTURER_PART_NUMBER: TPD4E1B06DRLR; MOUSER_PART_NUMBER: 595-TPD4E1B06DRLR; MOUSER_PRICE-STOCK: https://www.mouser.com/Search/Refine.aspx?Keyword=595-TPD4E1B06DRLR
IC1 = ADR4525ARZ:ADR4525ARZ: Analog Devices, ADR4525ARZ Analog Devices ADR4525ARZ, Series Voltage Reference 2.5V, /-0.02% 15 V max., 8-Pin SOIC Source: Datasheet <http://docs-emea.rs-online.com/webdocs/12d4/0900766b812d4ded.pdf>; DESCRIPTION: Analog Devices, ADR4525ARZ Analog Devices ADR4525ARZ, Series Voltage Reference 2.5V, /-0.02% 15 V max., 8-Pin SOIC; HEIGHT: 1.75mm; MANUFACTURER_NAME: Analog Devices; MANUFACTURER_PART_NUMBER: ADR4525ARZ; MOUSER_PART_NUMBER: 584-ADR4525ARZ; MOUSER_PRICE-STOCK: https://www.mouser.co.uk/ProductDetail/Analog-Devices/ADR4525ARZ?qs=WIvQP4zGangC7PeS%252B5s%2F2Q%3D%3D; RS_PART_NUMBER: 8023880P; RS_PRICE-STOCK: http://uk.rs-online.com/web/p/products/8023880P
J1 = SHF-105-01-L-D-TH-TR:SHF-105-01-L-D-TH-TR: Headers & Wire Housings .050" Shrouded Terminal Strip For FFSD Source: Datasheet <https://www.mouser.com/datasheet/2/527/shf-1370134.pdf>; DESCRIPTION: Headers & Wire Housings .050" Shrouded Terminal Strip For FFSD; HEIGHT: 5.33mm; MANUFACTURER_NAME: SAMTEC; MANUFACTURER_PART_NUMBER: SHF-105-01-L-D-TH-TR; MOUSER_PART_NUMBER: 200-SHF10501LDTHTR; MOUSER_PRICE-STOCK: https://www.mouser.co.uk/ProductDetail/Samtec/SHF-105-01-L-D-TH-TR?qs=%252BZP6%2F%252BtExtDFuyepp9uTfQ%3D%3D
J3 = 2040002-1:2040002-1: Conn USB Type B RCP 5 POS 0.65mm Solder RA SMD 5 Terminal 1 Port T/R; AVAILABILITY: Unavailable; CENTERLINE_PITCH: .65 mm[.025 in]; COMMENT: 2040002-1; DESCRIPTION: Conn Micro USB 2.0 Type B RCP 5 POS 0.65mm Solder RA SMD 5 Terminal 1 Port T/R; MF: TE Connectivity; MP: 2040002-1; NUMBER_OF_POSITIONS: 5; PACKAGE: None; PRICE: None; PRODUCT_TYPE: Connector; TE_PURCHASE_URL: https://www.te.com/usa-en/product-2040002-1.html?te_bu=Cor&te_type=disp&te_campaign=seda_glo_cor-seda-global-disp-prtnr-fy19-seda-model-bom-cta_sma-317_1&elqCampaignId=32493
LED1 LED2 = SamacSys_Parts:SML-P11MTT86R: ROHM - SML-P11MTT86R - LED, YELLOW GREEN, 2.1MCD, 569NM, 0402 Source: Datasheet <https://componentsearchengine.com/Datasheets/1/SML-P11MTT86R.pdf>; DESCRIPTION: ROHM - SML-P11MTT86R - LED, YELLOW GREEN, 2.1MCD, 569NM, 0402; HEIGHT: 0.25mm; MANUFACTURER_NAME: ROHM Semiconductor; MANUFACTURER_PART_NUMBER: SML-P11MTT86R; MOUSER_PART_NUMBER: 755-SML-P11MTT86R; MOUSER_PRICE-STOCK: https://www.mouser.com/Search/Refine.aspx?Keyword=755-SML-P11MTT86R
LED3 LED4 = SamacSys_Parts:150060RS75000: WURTH ELEKTRONIK - 150060RS75000 - LED, 0603, RED, 250MCD, 625NM Source: Datasheet <http://katalog.we-online.de/led/datasheet/150060RS75000.pdf>; DESCRIPTION: WURTH ELEKTRONIK - 150060RS75000 - LED, 0603, RED, 250MCD, 625NM; HEIGHT: 0.8mm; MANUFACTURER_NAME: Wurth Elektronik; MANUFACTURER_PART_NUMBER: 150060RS75000; MOUSER_PART_NUMBER: 710-150060RS75000; MOUSER_PRICE-STOCK: https://www.mouser.com/Search/Refine.aspx?Keyword=710-150060RS75000; RS_PART_NUMBER: 8154203P; RS_PRICE-STOCK: http://uk.rs-online.com/web/p/products/8154203P
R1-R40 R42 R44-R52 R54-R61 = CRCW06030000Z0EAC:CRCW06030000Z0EAC: Thick Film Resistors - SMD Source: Datasheet <https://www.vishay.com/docs/28773/crcwce3.pdf>; DESCRIPTION: Thick Film Resistors - SMD; HEIGHT: 0.55mm; MANUFACTURER_NAME: Vishay; MANUFACTURER_PART_NUMBER: CRCW06030000Z0EAC; MOUSER_PART_NUMBER: 71-CRCW06030000Z0EAC; MOUSER_PRICE-STOCK: https://www.mouser.com/Search/Refine.aspx?Keyword=71-CRCW06030000Z0EAC
R41 R43 R68 R69 = RC0201JR-071KL:RC0201JR-071KL: YAGEO - RC0201JR-071KL - RES, THICK FILM, 1K, 5%, 0.5W, 0201, REEL Source: Datasheet <http://www.yageo.com/documents/recent/PYu-RC0201_51_RoHS_L_8.pdf>; DESCRIPTION: YAGEO - RC0201JR-071KL - RES, THICK FILM, 1K, 5%, 0.5W, 0201, REEL; HEIGHT: 0.26mm; MANUFACTURER_NAME: YAGEO (PHYCOMP); MANUFACTURER_PART_NUMBER: RC0201JR-071KL; MOUSER_PART_NUMBER: 603-RC0201JR-071KL; MOUSER_PRICE-STOCK: https://www.mouser.co.uk/ProductDetail/Yageo/RC0201JR-071KL?qs=V1yeUXFNrklkaJ2L0z8I%252BA%3D%3D; RS_PART_NUMBER: 1987634; RS_PRICE-STOCK: http://uk.rs-online.com/web/p/products/1987634
R62 = CRCW0201200KFNED:CRCW0201200KFNED: VISHAY - CRCW0201200KFNED - RES, THICK FILM, 200K, 1%, 0.05W, 0201 Source: Datasheet <http://www.vishay.com/docs/20035/dcrcwe3.pdf>; DESCRIPTION: VISHAY - CRCW0201200KFNED - RES, THICK FILM, 200K, 1%, 0.05W, 0201; HEIGHT: 0.28mm; MANUFACTURER_NAME: Vishay; MANUFACTURER_PART_NUMBER: CRCW0201200KFNED; MOUSER_PART_NUMBER: 71-CRCW0201200KFNED; MOUSER_PRICE-STOCK: https://www.mouser.co.uk/ProductDetail/Vishay-Dale/CRCW0201200KFNED?qs=4bbongekVIR3iw5xFt9eBQ%3D%3D
R63 = ERA-3AEB823V:ERA-3AEB823V: RESISTOR, 0603 82 kOhm +/-0.1% 0.1 W Source: Datasheet <https://industrial.panasonic.com/cdbs/www-data/pdf/RDM0000/AOA0000C307.pdf>; DESCRIPTION: RESISTOR, 0603 82 kOhm +/-0.1% 0.1 W; HEIGHT: 0.55mm; MANUFACTURER_NAME: Panasonic; MANUFACTURER_PART_NUMBER: ERA-3AEB823V; MOUSER_PART_NUMBER: 667-ERA-3AEB823V; MOUSER_PRICE-STOCK: https://www.mouser.com/Search/Refine.aspx?Keyword=667-ERA-3AEB823V
R64 R65 = CRCW020141K2FNED:CRCW020141K2FNED: Thick Film Resistors - SMD 41.2K OHM 1% Source: Datasheet <http://www.vishay.com/docs/20035/dcrcwe3.pdf>; DESCRIPTION: Thick Film Resistors - SMD 41.2K OHM 1%; HEIGHT: 0.28mm; MANUFACTURER_NAME: Vishay; MANUFACTURER_PART_NUMBER: CRCW020141K2FNED; MOUSER_PART_NUMBER: 71-CRCW020141K2FNED; MOUSER_PRICE-STOCK: https://www.mouser.com/Search/Refine.aspx?Keyword=71-CRCW020141K2FNED
R70 R71 = RC0603JR-072K2L:RC0603JR-072K2L: RESISTOR, 0603 2.2K Ohms +/-5% 1/10 W Source: Datasheet <http://www.yageo.com/documents/recent/PYu-RC0603_51_RoHS_L_v5.pdf>; DESCRIPTION: RESISTOR, 0603 2.2K Ohms +/-5% 1/10 W; HEIGHT: 0.55mm; MANUFACTURER_NAME: YAGEO (PHYCOMP); MANUFACTURER_PART_NUMBER: RC0603JR-072K2L; MOUSER_PART_NUMBER: 603-RC0603JR-072K2L; MOUSER_PRICE-STOCK: https://www.mouser.co.uk/ProductDetail/Yageo/RC0603JR-072K2L?qs=%2F9ZTgpVJnN4N31C%252B33L1Sw%3D%3D
RESET = SamacSys_Parts:EVQ-Q2B03W: PANASONIC ELECTRONIC COMPONENTS - EVQ-Q2B03W - SWITCH, TACTILE, SPST-NO, 20mA, 15VDC, SMD Source: Datasheet <https://industrial.panasonic.com/cdbs/www-data/pdf/ATK0000/ATK0000C360.pdf>; ALLIED_NUMBER: 70270748; ALLIED_PRICE-STOCK: https://www.alliedelec.com/panasonic-evq-q2b03w/70270748/; DESCRIPTION: PANASONIC ELECTRONIC COMPONENTS - EVQ-Q2B03W - SWITCH, TACTILE, SPST-NO, 20mA, 15VDC, SMD; HEIGHT: mm; MANUFACTURER_NAME: Panasonic; MANUFACTURER_PART_NUMBER: EVQ-Q2B03W; MOUSER_PART_NUMBER: 667-EVQ-Q2B03W; MOUSER_PRICE-STOCK: https://www.mouser.com/Search/Refine.aspx?Keyword=667-EVQ-Q2B03W
S1 = JS102011SAQN:JS102011SAQN: C & K COMPONENTS - JS102011SAQN - SWITCH, SPDT, 0.6A, 6VDC, SIDE, SMD Source: Datasheet <http://www.ckswitches.com/media/1422/js.pdf>; ALLIED_NUMBER: 71173976; ALLIED_PRICE-STOCK: https://www.alliedelec.com/c-k-js102011saqn/71173976/; DESCRIPTION: C & K COMPONENTS - JS102011SAQN - SWITCH, SPDT, 0.6A, 6VDC, SIDE, SMD; HEIGHT: mm; MANUFACTURER_NAME: C & K COMPONENTS; MANUFACTURER_PART_NUMBER: JS102011SAQN; MOUSER_PART_NUMBER: 611-JS102011SAQN; MOUSER_PRICE-STOCK: https://www.mouser.com/Search/Refine.aspx?Keyword=611-JS102011SAQN; RS_PART_NUMBER: 1543603; RS_PRICE-STOCK: http://uk.rs-online.com/web/p/products/1543603
U2 = 1051:1051: Cylindrical Battery Contacts, Clips, Holders & Springs THM BATTERY HOLDER CR123A Source: Datasheet <https://www.keyelco.com/product-pdf.cfm?p=5205>; ALLIED_NUMBER: 71135178; ALLIED_PRICE-STOCK: https://www.alliedelec.com/keystoneelectronics-1051/71135178/; DESCRIPTION: Cylindrical Battery Contacts, Clips, Holders & Springs THM BATTERY HOLDER CR123A; HEIGHT: 15.24mm; MANUFACTURER_NAME: Keystone Electronics; MANUFACTURER_PART_NUMBER: 1051; MOUSER_PART_NUMBER: 534-1051; MOUSER_PRICE-STOCK: https://www.mouser.co.uk/ProductDetail/Keystone-Electronics/1051?qs=wOxb8XianXhV6wGCGUD6gA%3D%3D
U$13 = traumschreiber_custom_parts:N/C
VCC3.3_AN = traumschreiber_custom_parts:TPS73233DBVT: Cap-Free, NMOS, 250mA Low Dropout Regulator with Reverse Current Protection; MPN: TPS73233DBVT; OC_FARNELL: -; OC_NEWARK: 87H2968; PACKAGE: SOT-23-5; SUPPLIER: Texas Instruments
VCC3.3_DIG = SamacSys_Parts:ADP7118ACPZN3.3-R7: LDO Voltage Regulators 20V 200mA LDO 3.3Vo Source: Datasheet <https://www.analog.com/media/en/technical-documentation/data-sheets/adp7118.pdf>; DESCRIPTION: LDO Voltage Regulators 20V 200mA LDO 3.3Vo; HEIGHT: 0.65mm; MANUFACTURER_NAME: Linear Technology; MANUFACTURER_PART_NUMBER: ADP7118ACPZN3.3-R7; MOUSER_PART_NUMBER: 584-P7118ACPZN3.3R7; MOUSER_PRICE-STOCK: https://www.mouser.com/Search/Refine.aspx?Keyword=584-P7118ACPZN3.3R7

## Net classes
0 default: width 0.152 mm, drill 0.381 mm
1 power: width 0.305 mm, drill 0.381 mm
2 power2: width 0.381 mm, drill 0.381 mm